# Altium schematic sheet Relay Circuit.SchDoc
size A; SheetNumber: 11; SheetTotal: 11
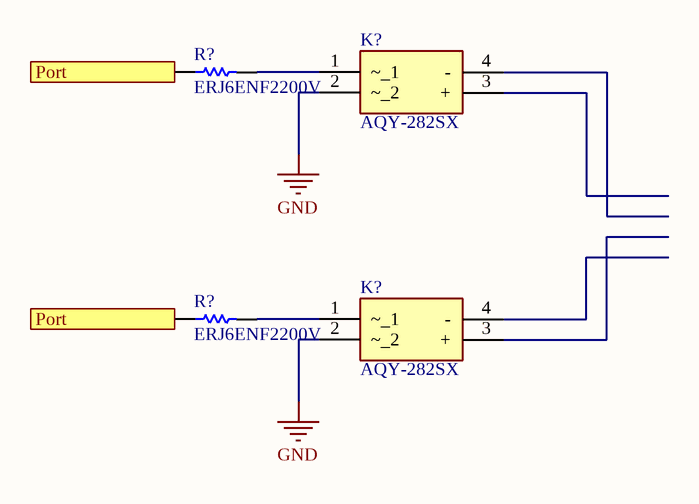
[diagram p0: Relay Circuit.SchDoc]

## Parts
(Parts that share a designator on the sheet are numbered #1, #2 ... from top to bottom, then left to right.)
K?#1  AQY-282SX  [SOP254P680X230-4N]
K?#2  AQY-282SX  [SOP254P680X230-4N]
R?#1  ERJ6ENF2200V  [RESC2013X70X40NL20T20]
R?#2  ERJ6ENF2200V  [RESC2013X70X40NL20T20]

## Ports
Port

## Nets
GND: K?#1.2(~_2) K?#2.2(~_2)
Port: R?#1.1 R?#2.1 ; port Port
NetK?#1_1: K?#1.1(~_1) R?#1.2
NetK?#2_1: K?#2.1(~_1) R?#2.2

Not connected (* = marked no-connect by the designer): K?#1 3(+) 4(-); K?#2 3(+) 4(-)

## Library data of the parts
K?#1 K?#2 = AQY-282SX: Relay or Contactor; Manufacturer_Name: Panasonic; Datasheet Link: https://componentsearchengine.com/Datasheets/2/AQY282SX.pdf; Height: 2.3mm; Manufacturer_Part_Number: AQY-282SX
R?#1 R?#2 = CMP-2001-00044-1: Manufacturer: Panasonic; Part Number: ERJ6ENF2200V